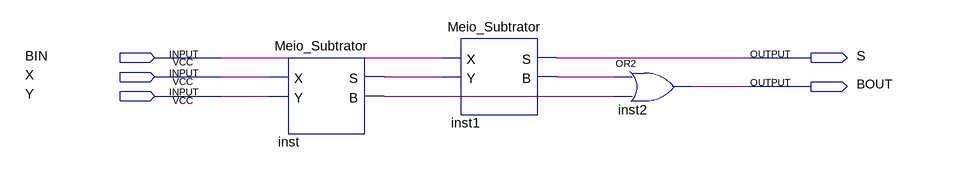
[diagram p0: schematic sheet]
// Quartus schematic Subtrator_Completo.bdf as structural Verilog: 3 symbols, 5 pins
module Subtrator_Completo (
  input  BIN,
  input  X,
  input  Y,
  output S,
  output BOUT
);

  wire inst1_b, inst_b, inst_s;

  Meio_Subtrator inst (.X(X), .Y(Y), .S(inst_s), .B(inst_b));
  Meio_Subtrator inst1 (.X(BIN), .Y(inst_s), .S(S), .B(inst1_b));
  or inst2 (BOUT, inst1_b, inst_b);
endmodule
